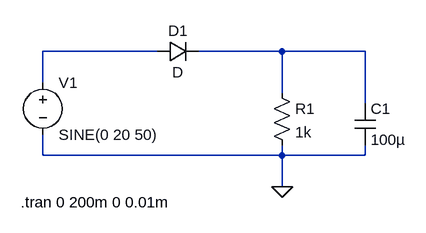
[diagram p0: schematic Zadatak01.asc]
Zadatak01.asc, the LTspice schematic file:
Version 4
SHEET 1 880 680
WIRE 192 -960 16 -960
WIRE 384 -960 256 -960
WIRE 512 -960 384 -960
WIRE 16 -912 16 -960
WIRE 384 -896 384 -960
WIRE 512 -880 512 -960
WIRE 16 -800 16 -832
WIRE 384 -800 384 -816
WIRE 384 -800 16 -800
WIRE 512 -800 512 -816
WIRE 512 -800 384 -800
WIRE 384 -752 384 -800
FLAG 384 -752 0
SYMBOL voltage 16 -928 R0
WINDOW 123 0 0 Left 0
WINDOW 39 0 0 Left 0
SYMATTR InstName V1
SYMATTR Value SINE(0 20 50)
SYMBOL res 368 -912 R0
SYMATTR InstName R1
SYMATTR Value 1k
SYMBOL cap 496 -880 R0
SYMATTR InstName C1
SYMATTR Value 100µ
SYMBOL diode 192 -944 R270
WINDOW 0 32 32 VTop 2
WINDOW 3 0 32 VBottom 2
SYMATTR InstName D1
TEXT -18 -728 Left 2 !.tran 0 200m 0 0.01m

The netlist it stands for:
* Zadatak01.asc
V1 N001 0 SINE(0 20 50)
R1 N002 0 1k
C1 N002 0 100µ
D1 N001 N002 D
.model D D
.lib standard.dio
.tran 0 200m 0 0.01m
.backanno
.end